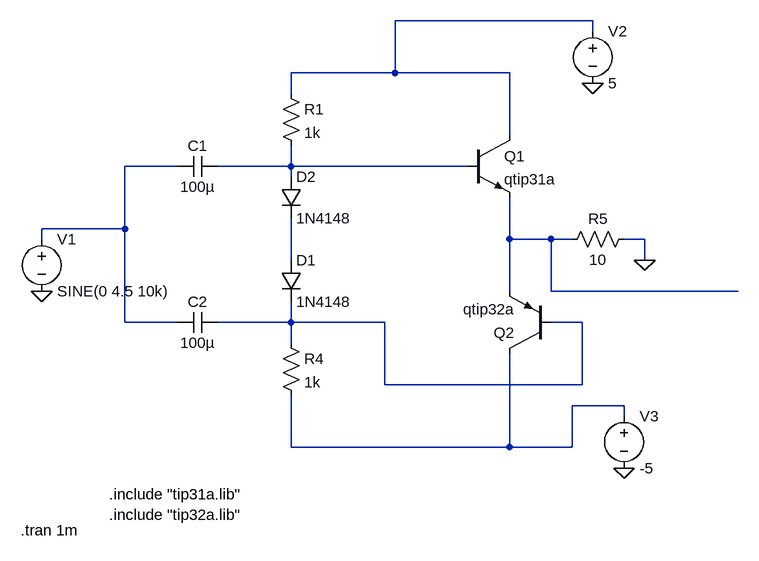
[diagram p0: schematic Power Amplifier.asc]
Power Amplifier.asc, the LTspice schematic file:
Version 4.1
SHEET 1 880 680
WIRE 400 -128 96 -128
WIRE 400 -112 400 -128
WIRE 96 -48 96 -128
WIRE 96 -48 -64 -48
WIRE 272 -48 96 -48
WIRE -64 -16 -64 -48
WIRE 272 48 272 -48
WIRE -240 96 -320 96
WIRE -64 96 -64 64
WIRE -64 96 -176 96
WIRE 208 96 -64 96
WIRE -64 112 -64 96
WIRE -320 192 -320 96
WIRE -320 192 -448 192
WIRE -448 208 -448 192
WIRE 272 208 272 144
WIRE 336 208 272 208
WIRE 368 208 336 208
WIRE 480 208 448 208
WIRE -64 240 -64 176
WIRE 480 240 480 208
WIRE 272 288 272 208
WIRE 336 288 336 208
WIRE 624 288 336 288
WIRE -320 336 -320 192
WIRE -240 336 -320 336
WIRE -64 336 -64 304
WIRE -64 336 -176 336
WIRE 80 336 -64 336
WIRE 384 336 336 336
WIRE -64 368 -64 336
WIRE 80 432 80 336
WIRE 384 432 384 336
WIRE 384 432 80 432
WIRE 448 464 368 464
WIRE 448 480 448 464
WIRE -64 528 -64 448
WIRE 272 528 272 384
WIRE 272 528 -64 528
WIRE 368 528 368 464
WIRE 368 528 272 528
FLAG -448 288 0
FLAG 480 240 0
FLAG 400 -32 0
FLAG 448 560 0
SYMBOL npn 208 48 R0
SYMATTR InstName Q1
SYMATTR Value qtip31a
SYMBOL pnp 336 384 R180
SYMATTR InstName Q2
SYMATTR Value qtip32a
SYMBOL res -80 -32 R0
SYMATTR InstName R1
SYMATTR Value 1k
SYMBOL res -80 352 R0
SYMATTR InstName R4
SYMATTR Value 1k
SYMBOL cap -176 80 R90
WINDOW 0 0 32 VBottom 2
WINDOW 3 32 32 VTop 2
SYMATTR InstName C1
SYMATTR Value 100µ
SYMBOL cap -176 320 R90
WINDOW 0 0 32 VBottom 2
WINDOW 3 32 32 VTop 2
SYMATTR InstName C2
SYMATTR Value 100µ
SYMBOL voltage -448 192 R0
WINDOW 123 0 0 Left 0
WINDOW 39 0 0 Left 0
SYMATTR InstName V1
SYMATTR Value SINE(0 4.5 10k)
SYMBOL voltage 400 -128 R0
WINDOW 123 0 0 Left 0
WINDOW 39 0 0 Left 0
SYMATTR InstName V2
SYMATTR Value 5
SYMBOL res 464 192 R90
WINDOW 0 0 56 VBottom 2
WINDOW 3 32 56 VTop 2
SYMATTR InstName R5
SYMATTR Value 10
SYMBOL voltage 448 464 R0
WINDOW 123 0 0 Left 0
WINDOW 39 0 0 Left 0
SYMATTR InstName V3
SYMATTR Value -5
SYMBOL diode -80 240 R0
SYMATTR InstName D1
SYMATTR Value 1N4148
SYMBOL diode -80 112 R0
SYMATTR InstName D2
SYMATTR Value 1N4148
TEXT -344 600 Left 2 !.include "tip31a.lib"
TEXT -344 632 Left 2 !.include "tip32a.lib"
TEXT -480 656 Left 2 !.tran 1m

The netlist it stands for:
* Power Amplifier.asc
Q1 N001 N003 N004 0 qtip31a
Q2 N007 N006 N004 0 qtip32a
R1 N001 N003 1k
R4 N006 N007 1k
C1 N003 N002 100µ
C2 N006 N002 100µ
V1 N002 0 SINE(0 4.5 10k)
V2 N001 0 5
R5 0 N004 10
V3 N007 0 -5
D1 N005 N006 1N4148
D2 N003 N005 1N4148
.model D D
.lib standard.dio
.model NPN NPN
.model PNP PNP
.lib standard.bjt
.include "tip31a.lib"
.include "tip32a.lib"
.tran 1m
.backanno
.end